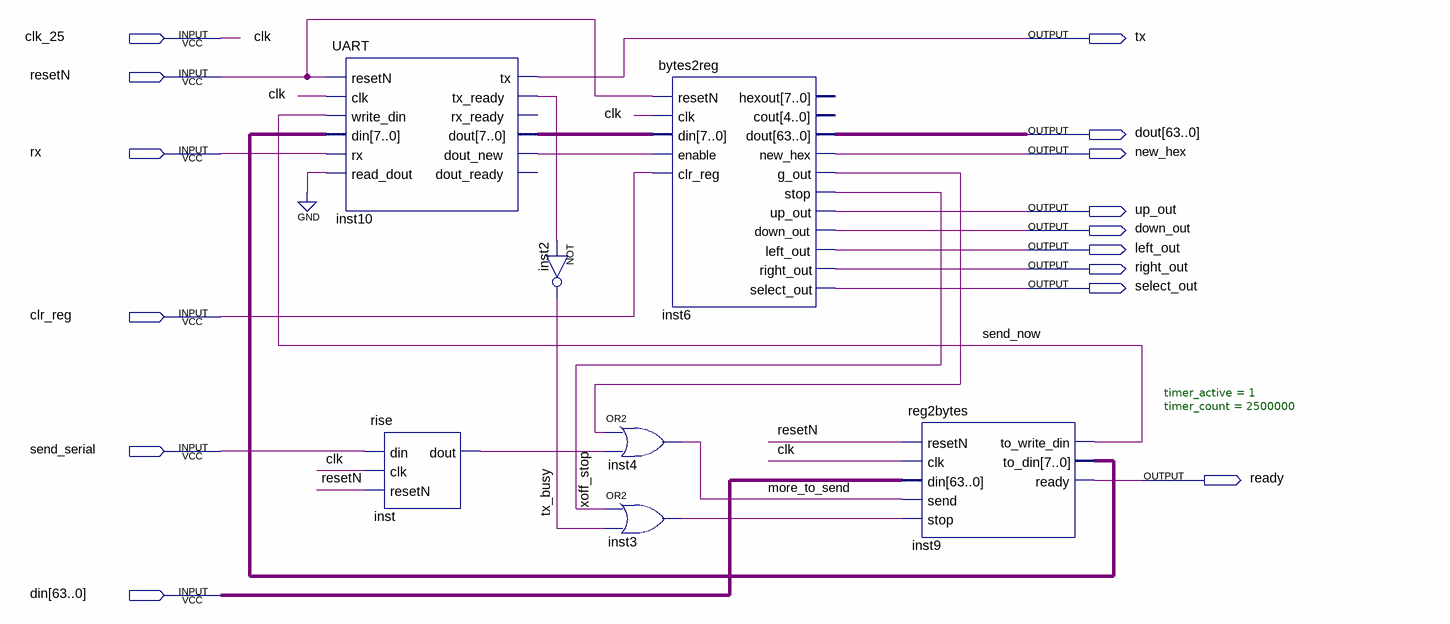
[diagram p0: schematic sheet]
// Quartus schematic hexcon.bdf as structural Verilog: 7 symbols, 15 pins
module hexcon (
  input  clk_25,
  input  resetN,
  input  rx,
  input  clr_reg,
  input  send_serial,
  input  [63:0] din,
  output tx,
  output [63:0] dout,
  output new_hex,
  output up_out,
  output down_out,
  output left_out,
  output right_out,
  output select_out,
  output ready
);

  wire inst3_out, inst6_g_out, inst10_dout_new, inst10_tx_ready, inst_dout, more_to_send, send_now, tx_busy,
       xoff_stop;
  wire [7:0] inst9_to_din, inst10_dout;

  UART inst10 (
    .resetN(resetN), .clk(clk_25), .write_din(send_now), .din(inst9_to_din), .rx(rx), .read_dout(1'b0),
    .tx(tx), .tx_ready(inst10_tx_ready), .dout(inst10_dout), .dout_new(inst10_dout_new));  // open: rx_ready, dout_ready
  rise inst (.din(send_serial), .clk(clk_25), .resetN(resetN), .dout(inst_dout));
  not inst2 (tx_busy, inst10_tx_ready);
  or inst4 (more_to_send, inst6_g_out, inst_dout);
  or inst3 (inst3_out, xoff_stop, tx_busy);
  bytes2reg inst6 (
    .resetN(resetN), .clk(clk_25), .din(inst10_dout), .enable(inst10_dout_new), .clr_reg(clr_reg),
    .dout(dout), .new_hex(new_hex), .g_out(inst6_g_out), .stop(xoff_stop), .up_out(up_out),
    .down_out(down_out), .left_out(left_out), .right_out(right_out), .select_out(select_out));  // open: hexout, cout
  reg2bytes #(.timer_active(1), .timer_count(2500000)) inst9 (
    .resetN(resetN), .clk(clk_25), .din(din), .send(more_to_send), .stop(inst3_out), .to_write_din(send_now),
    .to_din(inst9_to_din), .ready(ready));

  // Other names for the same wires on the sheet: clk = clk_25
endmodule
